# Altium project bga_fast.PrjPcb (part 2 of 2)
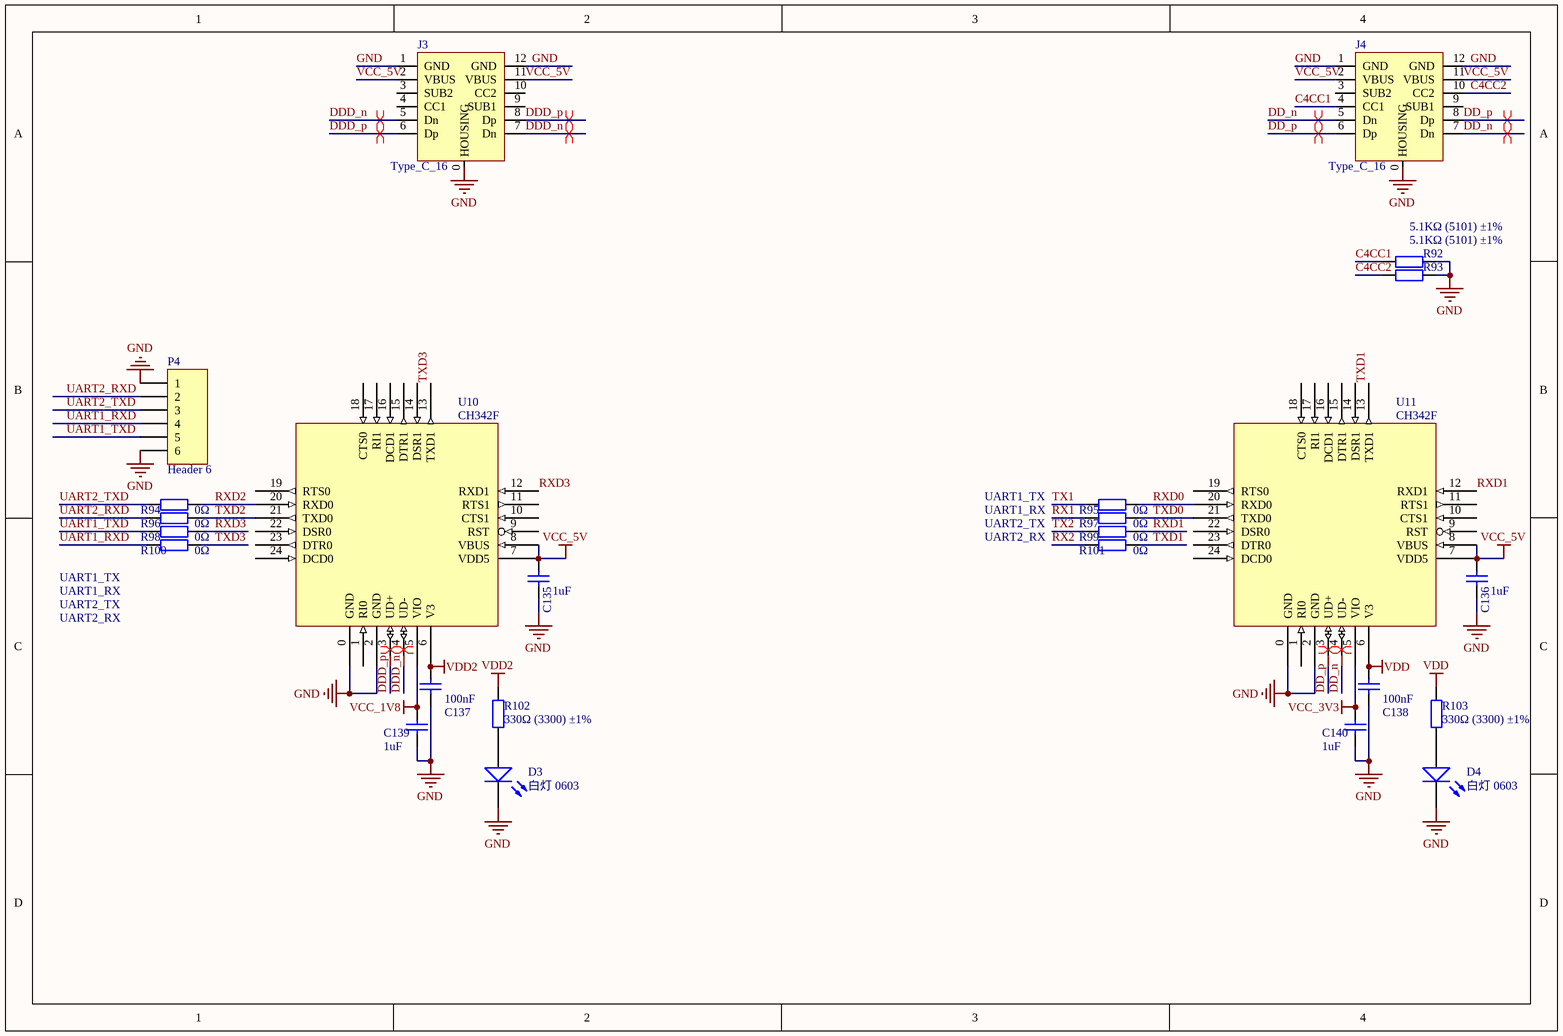
[diagram p5: debug.SchDoc]

## Nets that join several sheets
GND: mcu (87 pins), zynq (135 pins), jtag (30 pins), power (116 pins), debug (22 pins)
VCC_1V0: zynq (27 pins), power (L2.3)
VCC_1V5: zynq (21 pins), power (L4.3)
VCC_1V8: zynq (35 pins), jtag (R33.2), power (L3.3), debug (C139.2 U10.5)
VCC_3V3: mcu (6 pins), zynq (58 pins), jtag (18 pins), power (L5.3), debug (C140.2 U11.5)
VCC_5V: mcu (J1.2 J1.11), power (52 pins), debug (10 pins)
JTAG_TCK: zynq (U2.F9), jtag (P3.7 R40.2)
JTAG_TDI: zynq (U2.G6), jtag (P3.6 R38.2)
JTAG_TDO: zynq (U2.F6), jtag (P3.5 R37.2)
JTAG_TMS: zynq (U2.J6), jtag (P3.4 R36.2)
RX1: mcu (P1.3 R10.2), debug (R97.1)
RX2: mcu (P1.5 R12.2), debug (R101.1)
TX1: mcu (P1.2 R8.2), debug (R95.1)
TX2: mcu (P1.4 R11.2), debug (R99.1)
U1D_n: jtag (R41.1), power (J2.5 J2.7)
U1D_p: jtag (R42.1), power (J2.6 J2.8)
UART1_RXD: zynq (U2.C5), debug (P4.4 R100.1)
UART1_TXD: zynq (U2.C8), debug (P4.5 R98.1)
UART2_RXD: zynq (U2.D9), debug (P4.2 R96.1)
UART2_TXD: zynq (U2.E8), debug (P4.3 R94.1)